# EAGLE design me433_2019_pic32 (EAGLE 9.3.2)
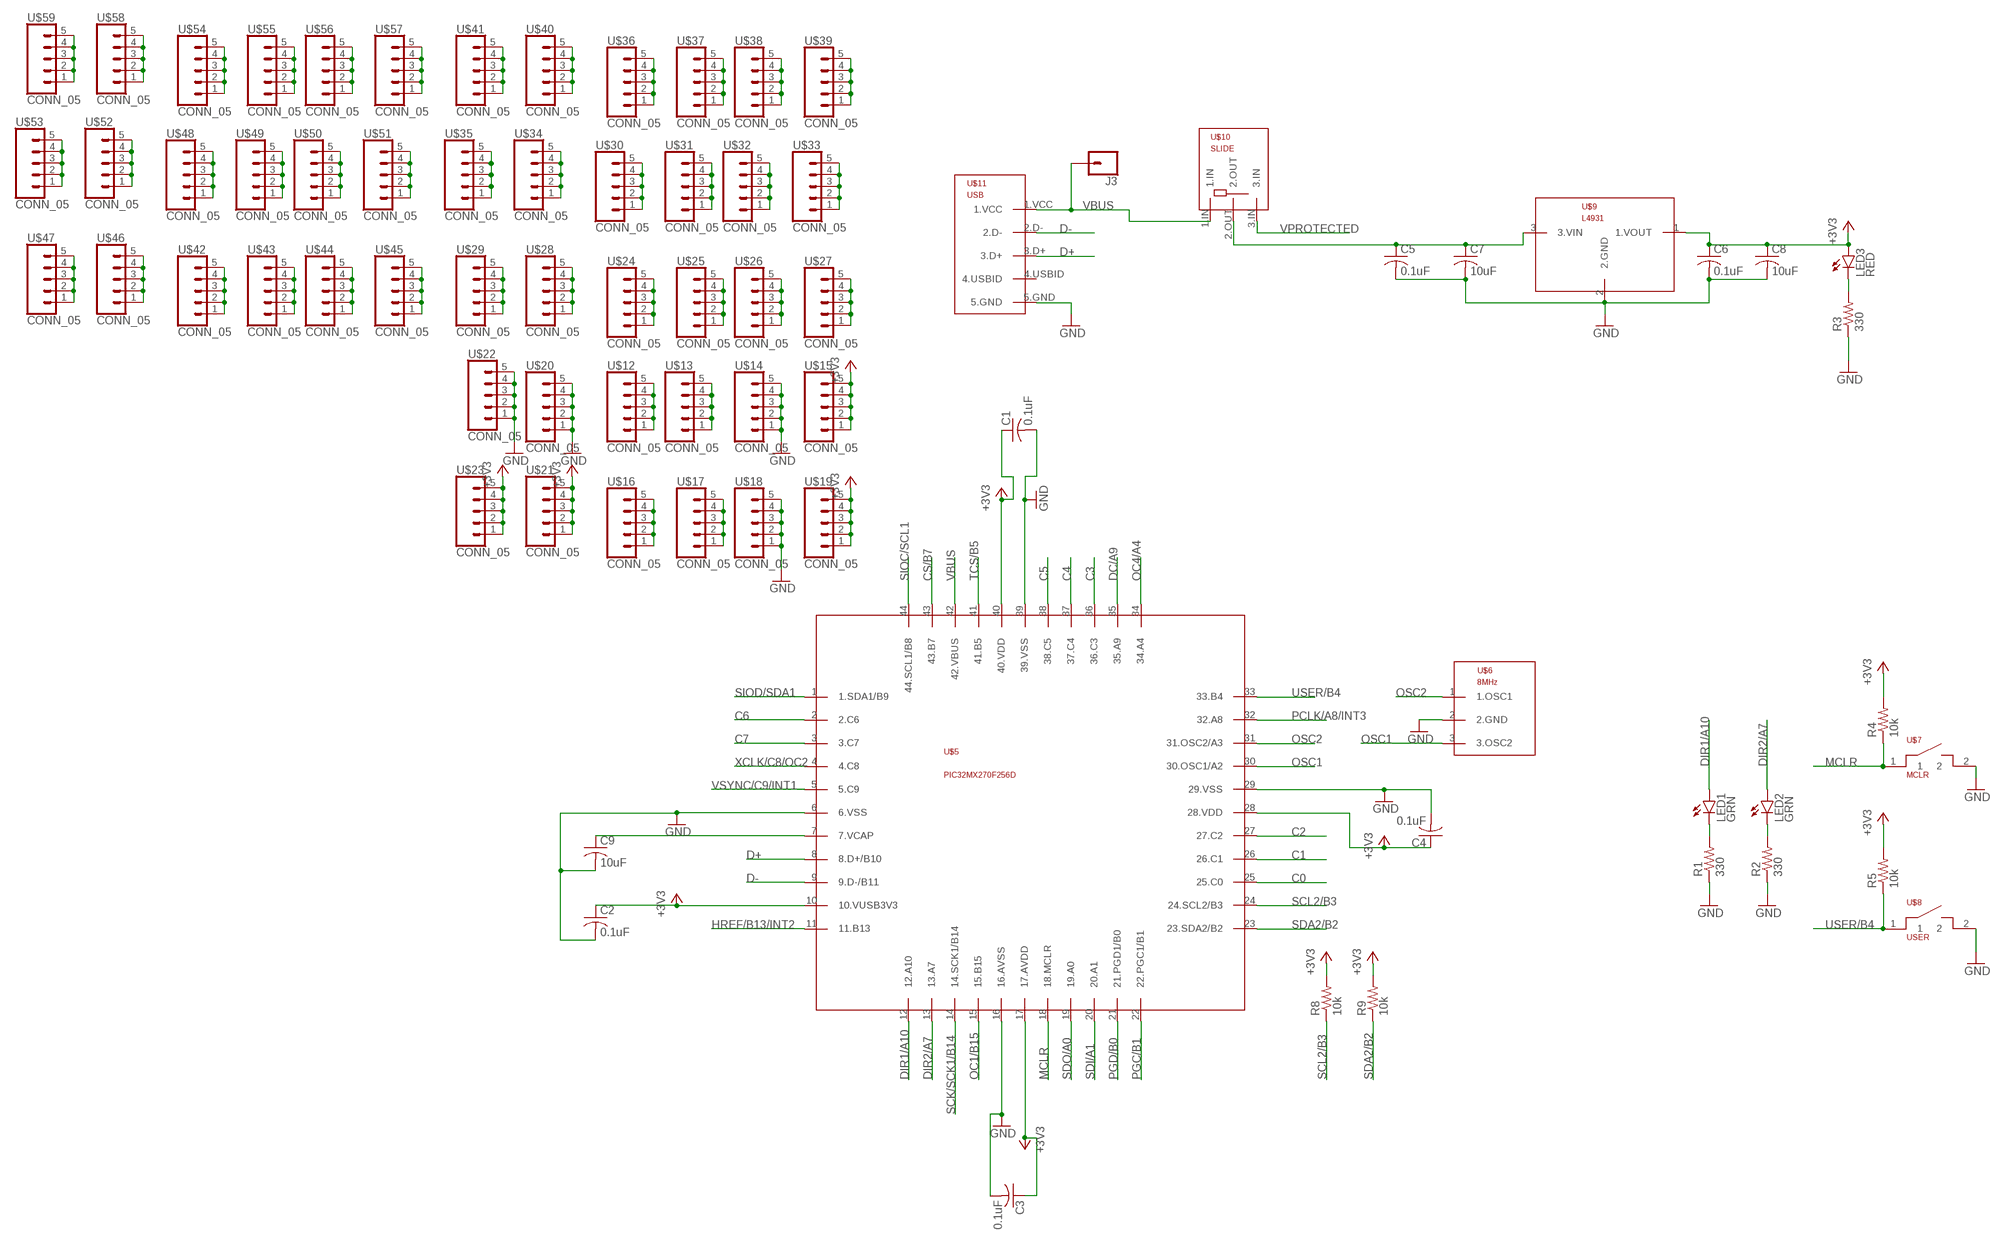
[diagram p0: schematic, sheet 1, part 1 of 2]
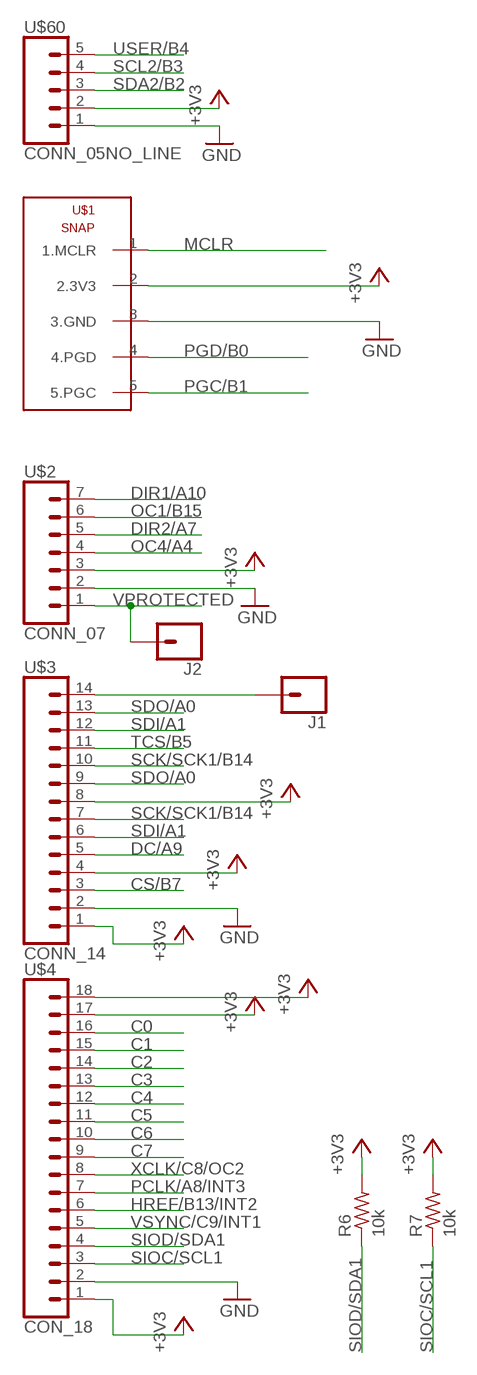
[diagram p1: schematic, sheet 1, part 2 of 2]

## Parts
C1  0.1uF  C-US025-030X050  [C025-030X050]
C2  0.1uF  C-US025-030X050  [C025-030X050]
C3  0.1uF  C-US025-030X050  [C025-030X050]
C4  0.1uF  C-US025-030X050  [C025-030X050]
C5  0.1uF  C-US025-030X050  [C025-030X050]
C6  0.1uF  C-US025-030X050  [C025-030X050]
C7  10uF  C-US025-030X050  [C025-030X050]
C8  10uF  C-US025-030X050  [C025-030X050]
C9  10uF  C-US025-030X050  [C025-030X050]
J1  CONN_01  [1X01]
J2  CONN_01  [1X01]
J3  CONN_01  [1X01]
LED1  GRN  LED3MM  [LED3MM]
LED2  GRN  LED3MM  [LED3MM]
LED3  RED  LED3MM  [LED3MM]
R1  330  R-US_0207/10  [0207/10]
R2  330  R-US_0207/10  [0207/10]
R3  330  R-US_0207/10  [0207/10]
R4  10k  R-US_0207/10  [0207/10]
R5  10k  R-US_0207/10  [0207/10]
R6  10k  R-US_0207/10  [0207/10]
R7  10k  R-US_0207/10  [0207/10]
R8  10k  R-US_0207/10  [0207/10]
R9  10k  R-US_0207/10  [0207/10]
U$1  SNAP  SNAPSNAP  [SNAP]
U$2  CONN_07  [1X07]
U$3  CONN_14  [1X14]
U$4  CON_18  [1X18]
U$5  PIC32MX270F256D  [TQFP44]
U$6  8MHz  OSC  [OSC]
U$7  MCLR  PB  [PB]
U$8  USER  PB  [PB]
U$9  L4931  [L4931]
U$10  SLIDE  [SLIDE]
U$11  USB  [USB]
U$12  CONN_05  [1X05]
U$13  CONN_05  [1X05]
U$14  CONN_05  [1X05]
U$15  CONN_05  [1X05]
U$16  CONN_05  [1X05]
U$17  CONN_05  [1X05]
U$18  CONN_05  [1X05]
U$19  CONN_05  [1X05]
U$20  CONN_05  [1X05]
U$21  CONN_05  [1X05]
U$22  CONN_05  [1X05]
U$23  CONN_05  [1X05]
U$24  CONN_05  [1X05]
U$25  CONN_05  [1X05]
U$26  CONN_05  [1X05]
U$27  CONN_05  [1X05]
U$28  CONN_05  [1X05]
U$29  CONN_05  [1X05]
U$30  CONN_05  [1X05]
U$31  CONN_05  [1X05]
U$32  CONN_05  [1X05]
U$33  CONN_05  [1X05]
U$34  CONN_05  [1X05]
U$35  CONN_05  [1X05]
U$36  CONN_05  [1X05]
U$37  CONN_05  [1X05]
U$38  CONN_05  [1X05]
U$39  CONN_05  [1X05]
U$40  CONN_05  [1X05]
U$41  CONN_05  [1X05]
U$42  CONN_05  [1X05]
U$43  CONN_05  [1X05]
U$44  CONN_05  [1X05]
U$45  CONN_05  [1X05]
U$46  CONN_05  [1X05]
U$47  CONN_05  [1X05]
U$48  CONN_05  [1X05]
U$49  CONN_05  [1X05]
U$50  CONN_05  [1X05]
U$51  CONN_05  [1X05]
U$52  CONN_05  [1X05]
U$53  CONN_05  [1X05]
U$54  CONN_05  [1X05]
U$55  CONN_05  [1X05]
U$56  CONN_05  [1X05]
U$57  CONN_05  [1X05]
U$58  CONN_05  [1X05]
U$59  CONN_05  [1X05]
U$60  CONN_05NO_LINE  [1X05_NO_LINE]

## Nets
+3V3: C1.1 C2.1 C3.1 C4.1 C6.1 C8.1 LED3.A R4.2 R5.2 R6.2 R7.2 R8.2 R9.2 U$1.2(2.3V3) U$2.3 U$3.1 U$3.4 U$3.8 U$4.1 U$4.17 U$4.18 U$5.10(10.VUSB3V3) U$5.17(17.AVDD) U$5.28(28.VDD) U$5.40(40.VDD) U$9.1(1.VOUT) U$15.1 U$15.2 U$15.3 U$15.4 U$15.5 U$19.1 U$19.2 U$19.3 U$19.4 U$19.5 U$21.1 U$21.2 U$21.3 U$21.4 U$21.5 U$23.1 U$23.2 U$23.3 U$23.4 U$23.5 U$60.2
C0: U$4.16 U$5.25(25.C0)
C1: U$4.15 U$5.26(26.C1)
C2: U$4.14 U$5.27(27.C2)
C3: U$4.13 U$5.36(36.C3)
C4: U$4.12 U$5.37(37.C4)
C5: U$4.11 U$5.38(38.C5)
C6: U$4.10 U$5.2(2.C6)
C7: U$4.9 U$5.3(3.C7)
CS/B7: U$3.3 U$5.43(43.B7)
D+: U$5.8(8.D+/B10) U$11.3.D+
D-: U$5.9(9.D-/B11) U$11.2.D-
DC/A9: U$3.5 U$5.35(35.A9)
DIR1/A10: LED1.A U$2.7 U$5.12(12.A10)
DIR2/A7: LED2.A U$2.5 U$5.13(13.A7)
GND: C1.2 C2.2 C3.2 C4.2 C5.2 C6.2 C7.2 C8.2 C9.2 R1.1 R2.1 R3.1 U$1.3(3.GND) U$2.2 U$3.2 U$4.2 U$5.6(6.VSS) U$5.16(16.AVSS) U$5.29(29.VSS) U$5.39(39.VSS) U$6.2(2.GND) U$7.2 U$8.2 U$9.2(2.GND) U$11.5.GND U$14.1 U$14.2 U$14.3 U$14.4 U$14.5 U$18.1 U$18.2 U$18.3 U$18.4 U$18.5 U$20.1 U$20.2 U$20.3 U$20.4 U$20.5 U$22.1 U$22.2 U$22.3 U$22.4 U$22.5 U$60.1
HREF/B13/INT2: U$4.6 U$5.11(11.B13)
MCLR: R4.1 U$1.1(1.MCLR) U$5.18(18.MCLR) U$7.1
N$1: C9.1 U$5.7(7.VCAP)
N$2: LED1.K(C) R1.2
N$3: LED2.K(C) R2.2
N$4: J1.1 U$3.14
N$5: C5.1 C7.1 U$9.3(3.VIN) U$10.2.OUT
N$6: U$12.1 U$12.2 U$12.3 U$12.4 U$12.5
N$7: U$13.1 U$13.2 U$13.3 U$13.4 U$13.5
N$9: LED3.K(C) R3.2
N$11: U$16.1 U$16.2 U$16.3 U$16.4 U$16.5
N$12: U$17.1 U$17.2 U$17.3 U$17.4 U$17.5
N$19: U$24.1 U$24.2 U$24.3 U$24.4 U$24.5
N$20: U$25.1 U$25.2 U$25.3 U$25.4 U$25.5
N$21: U$26.1 U$26.2 U$26.3 U$26.4 U$26.5
N$22: U$27.1 U$27.2 U$27.3 U$27.4 U$27.5
N$23: U$28.1 U$28.2 U$28.3 U$28.4 U$28.5
N$24: U$29.1 U$29.2 U$29.3 U$29.4 U$29.5
N$25: U$30.1 U$30.2 U$30.3 U$30.4 U$30.5
N$26: U$31.1 U$31.2 U$31.3 U$31.4 U$31.5
N$27: U$32.1 U$32.2 U$32.3 U$32.4 U$32.5
N$28: U$33.1 U$33.2 U$33.3 U$33.4 U$33.5
N$29: U$34.1 U$34.2 U$34.3 U$34.4 U$34.5
N$30: U$35.1 U$35.2 U$35.3 U$35.4 U$35.5
N$31: U$36.1 U$36.2 U$36.3 U$36.4 U$36.5
N$32: U$37.1 U$37.2 U$37.3 U$37.4 U$37.5
N$33: U$38.1 U$38.2 U$38.3 U$38.4 U$38.5
N$34: U$39.1 U$39.2 U$39.3 U$39.4 U$39.5
N$35: U$40.1 U$40.2 U$40.3 U$40.4 U$40.5
N$36: U$41.1 U$41.2 U$41.3 U$41.4 U$41.5
N$37: U$42.1 U$42.2 U$42.3 U$42.4 U$42.5
N$38: U$43.1 U$43.2 U$43.3 U$43.4 U$43.5
N$39: U$44.1 U$44.2 U$44.3 U$44.4 U$44.5
N$40: U$45.1 U$45.2 U$45.3 U$45.4 U$45.5
N$41: U$46.1 U$46.2 U$46.3 U$46.4 U$46.5
N$42: U$47.1 U$47.2 U$47.3 U$47.4 U$47.5
N$43: U$48.1 U$48.2 U$48.3 U$48.4 U$48.5
N$44: U$49.1 U$49.2 U$49.3 U$49.4 U$49.5
N$45: U$50.1 U$50.2 U$50.3 U$50.4 U$50.5
N$46: U$51.1 U$51.2 U$51.3 U$51.4 U$51.5
N$47: U$52.1 U$52.2 U$52.3 U$52.4 U$52.5
N$48: U$53.1 U$53.2 U$53.3 U$53.4 U$53.5
N$49: U$54.1 U$54.2 U$54.3 U$54.4 U$54.5
N$50: U$55.1 U$55.2 U$55.3 U$55.4 U$55.5
N$51: U$56.1 U$56.2 U$56.3 U$56.4 U$56.5
N$52: U$57.1 U$57.2 U$57.3 U$57.4 U$57.5
N$53: U$58.1 U$58.2 U$58.3 U$58.4 U$58.5
N$54: U$59.1 U$59.2 U$59.3 U$59.4 U$59.5
OC1/B15: U$2.6 U$5.15(15.B15)
OC4/A4: U$2.4 U$5.34(34.A4)
OSC1: U$5.30(30.OSC1/A2) U$6.3(3.OSC2)
OSC2: U$5.31(31.OSC2/A3) U$6.1(1.OSC1)
PCLK/A8/INT3: U$4.7 U$5.32(32.A8)
PGC/B1: U$1.5(5.PGC) U$5.22(22.PGC1/B1)
PGD/B0: U$1.4(4.PGD) U$5.21(21.PGD1/B0)
SCK/SCK1/B14: U$3.7 U$3.10 U$5.14(14.SCK1/B14)
SCL2/B3: R8.1 U$5.24(24.SCL2/B3) U$60.4
SDA2/B2: R9.1 U$5.23(23.SDA2/B2) U$60.3
SDI/A1: U$3.6 U$3.12 U$5.20(20.A1)
SDO/A0: U$3.9 U$3.13 U$5.19(19.A0)
SIOC/SCL1: R7.1 U$4.3 U$5.44(44.SCL1/B8)
SIOD/SDA1: R6.1 U$4.4 U$5.1(1.SDA1/B9)
TCS/B5: U$3.11 U$5.41(41.B5)
USER/B4: R5.1 U$5.33(33.B4) U$8.1 U$60.5
VBUS: J3.1 U$5.42(42.VBUS) U$10.1.IN U$11.1.VCC
VPROTECTED: J2.1 U$2.1 U$10.3.IN
VSYNC/C9/INT1: U$4.5 U$5.5(5.C9)
XCLK/C8/OC2: U$4.8 U$5.4(4.C8)
Unconnected: U$11.4.USBID

## Library data of the parts
C1-C9 = resistor:C-US: CAPACITOR, American symbol
J1-J3 = SparkFun-Connectors:CONN_01: Single connection point. Often used as Generic Header-pin footprint for 0.1 inch spaced/style header connections On any of the 0.1 inch spaced packages, you can populate with these: Break Away Headers - Straight <https://www.sparkfun.com/products/116> (PRT-00116) Break Away Male Headers - Right Angle <https://www.sparkfun.com/products/553> (PRT-00553) Female Headers <https://www.sparkfun.com/products/115> (PRT-00115) Break Away Headers - Machine Pin <https://www.sparkfun.com/products/117> (PRT-00117) Break Away Female Headers - Swiss Machine Pin <https://www.sparkfun.com/products/743> (PRT-00743) This device is also useful as a general connection point to wire up your design to another part of your project. Our various solder wires solder well into these plated through hole pads. Hook-Up Wire - Assortment (Stranded, 22 AWG) <https://www.sparkfun.com/products/11375> (PRT-11375) Hook-Up Wire - Assortment (Solid Core, 22 AWG) <https://www.sparkfun.com/products/11367> (PRT-11367) View the entire wire category on our website here <https://www.sparkfun.com/categories/141> Special notes: SMTSO-256-ET is a "flush mount" nut for a 4-40 screw. We mostly use this on specialty testbeds; it is a nice way to connect hardware to your PCB at an adjustable hieght. Also note, the SNAP packages are for using a snappable style connector. We sell a baggie of snaps and they are also used on two LilyPad designs: Snap Assortment - 30 pack (male and female) <https://www.sparkfun.com/products/11347> (DEV-11347) LilyPad Arduino SimpleSnap <https://www.sparkfun.com/products/10941> (DEV-10941) LilyPad SimpleSnap Protoboard <https://www.sparkfun.com/products/10940> (DEV-10940)
LED1-LED3 = led:LED: LED OSRAM: - CHIPLED LG R971, LG N971, LY N971, LG Q971, LY Q971, LO R971, LY R971 LH N974, LH R974 LS Q976, LO Q976, LY Q976 LO Q996 - Hyper CHIPLED LW Q18S LB Q993, LB Q99A, LB R99A - SideLED LS A670, LO A670, LY A670, LG A670, LP A670 LB A673, LV A673, LT A673, LW A673 LH A674 LY A675 LS A676, LA A676, LO A676, LY A676, LW A676 LS A679, LY A679, LG A679 - Hyper Micro SIDELED® LS Y876, LA Y876, LO Y876, LY Y876 LT Y87S - SmartLED LW L88C, LW L88S LB L89C, LB L89S, LG L890 LS L89K, LO L89K, LY L89K LS L896, LA L896, LO L896, LY L896 - TOPLED LS T670, LO T670, LY T670, LG T670, LP T670 LSG T670, LSP T670, LSY T670, LOP T670, LYG T670 LG T671, LOG T671, LSG T671 LB T673, LV T673, LT T673, LW T673 LH T674 LS T676, LA T676, LO T676, LY T676, LB T676, LH T676, LSB T676, LW T676 LB T67C, LV T67C, LT T67C, LS T67K, LO T67K, LY T67K, LW E67C LS E67B, LA E67B, LO E67B, LY E67B, LB E67C, LV E67C, LT E67C LW T67C LS T679, LY T679, LG T679 LS T770, LO T770, LY T770, LG T770, LP T770 LB T773, LV T773, LT T773, LW T773 LH T774 LS E675, LA E675, LY E675, LS T675 LS T776, LA T776, LO T776, LY T776, LB T776 LHGB T686 LT T68C, LB T68C - Hyper Mini TOPLED® LB M676 - Mini TOPLED Santana® LG M470 LS M47K, LO M47K, LY M47K Source: http://www.osram.convergy.de LUXEON: - LUMILED® LXK2-PW12-R00, LXK2-PW12-S00, LXK2-PW14-U00, LXK2-PW14-V00 LXK2-PM12-R00, LXK2-PM12-S00, LXK2-PM14-U00 LXK2-PE12-Q00, LXK2-PE12-R00, LXK2-PE12-S00, LXK2-PE14-T00, LXK2-PE14-U00 LXK2-PB12-K00, LXK2-PB12-L00, LXK2-PB12-M00, LXK2-PB14-N00, LXK2-PB14-P00, LXK2-PB14-Q00 LXK2-PR12-L00, LXK2-PR12-M00, LXK2-PR14-Q00, LXK2-PR14-R00 LXK2-PD12-Q00, LXK2-PD12-R00, LXK2-PD12-S00 LXK2-PH12-R00, LXK2-PH12-S00 LXK2-PL12-P00, LXK2-PL12-Q00, LXK2-PL12-R00 Source: www.luxeon.com KINGBRIGHT: KA-3528ASYC Source: www.kingbright.com
R1-R9 = resistor:R-US_: RESISTOR, American symbol
U$1 = me433_2019_pic32:SNAP
U$2 = me433_2019_pic32:CONN_07
U$3 = me433_2019_pic32:CONN_14
U$4 = me433_2019_pic32:CON_18
U$5 = me433_2019_pic32:PIC32MX270F256D
U$6 = me433_2019_pic32:OSC
U$7 U$8 = me433_2019_pic32:PB
U$9 = me433_2019_pic32:L4931
U$10 = me433_2019_pic32:SLIDE
U$11 = me433_2019_pic32:USB
U$12-U$60 = me433_2019_pic32:CONN_05

## Board
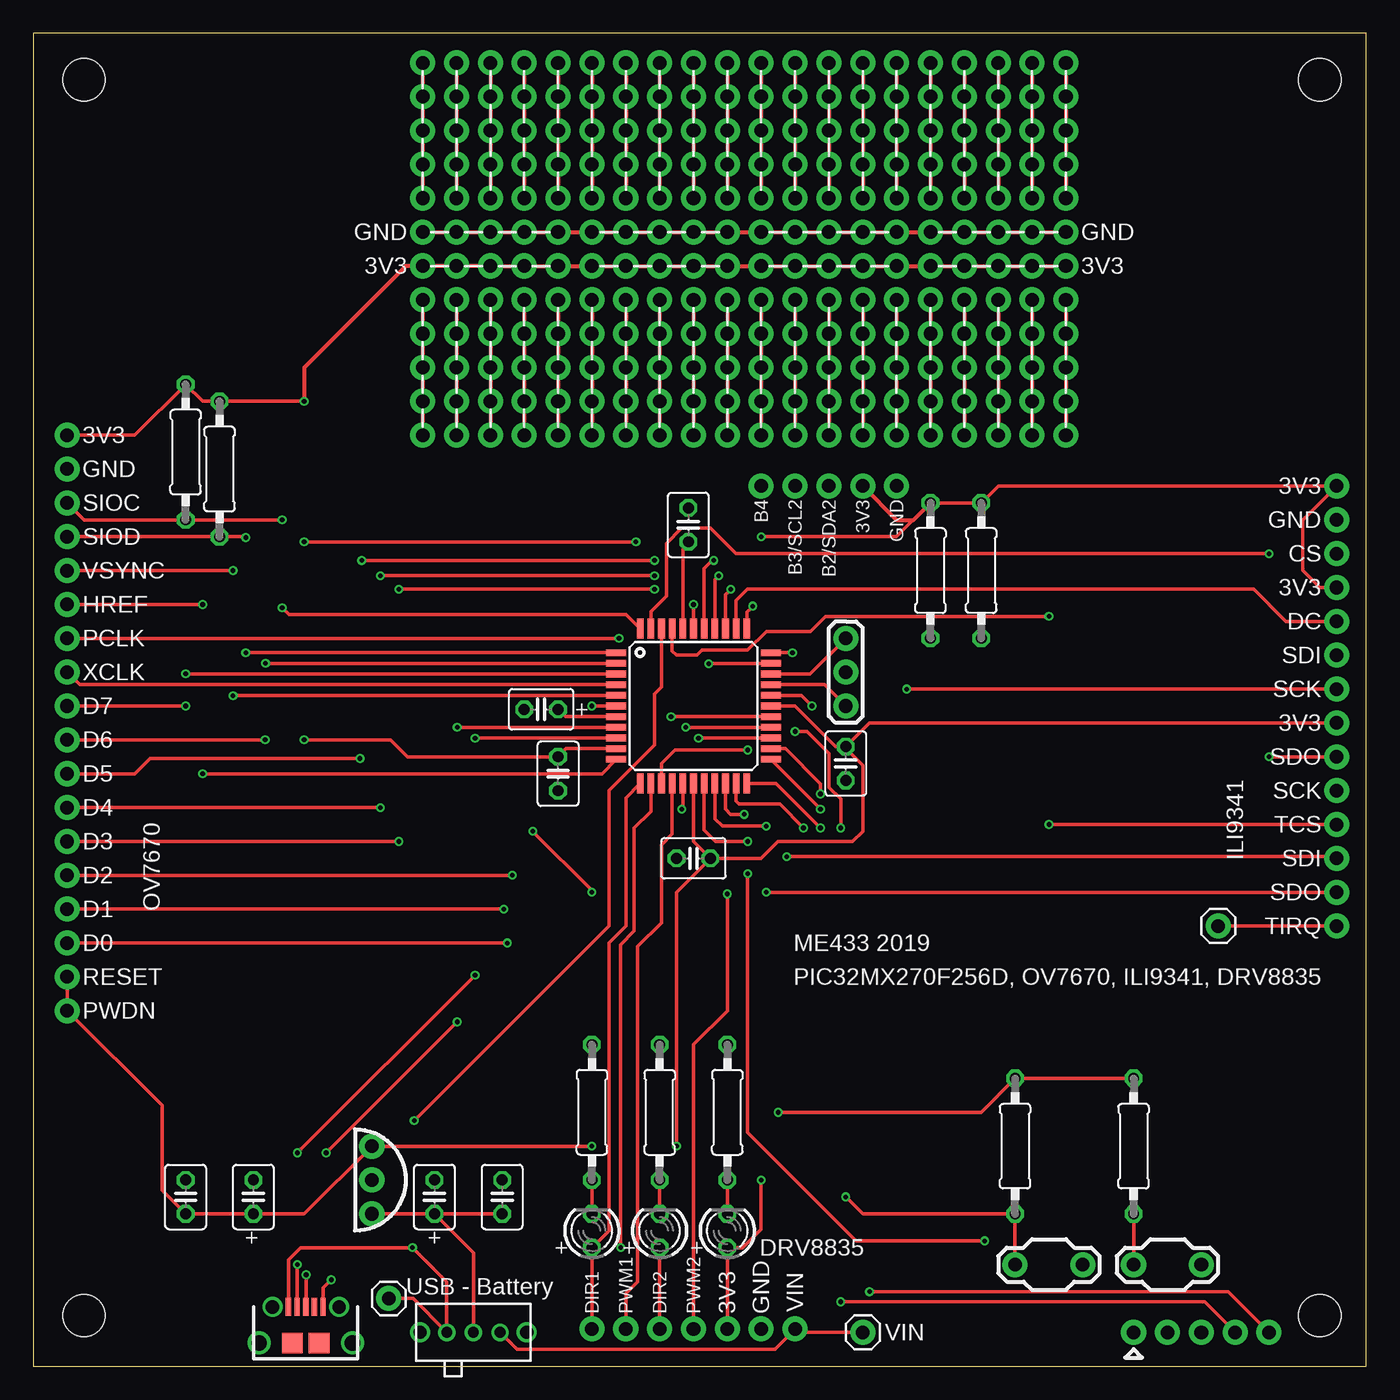
[diagram p2: board, top side]
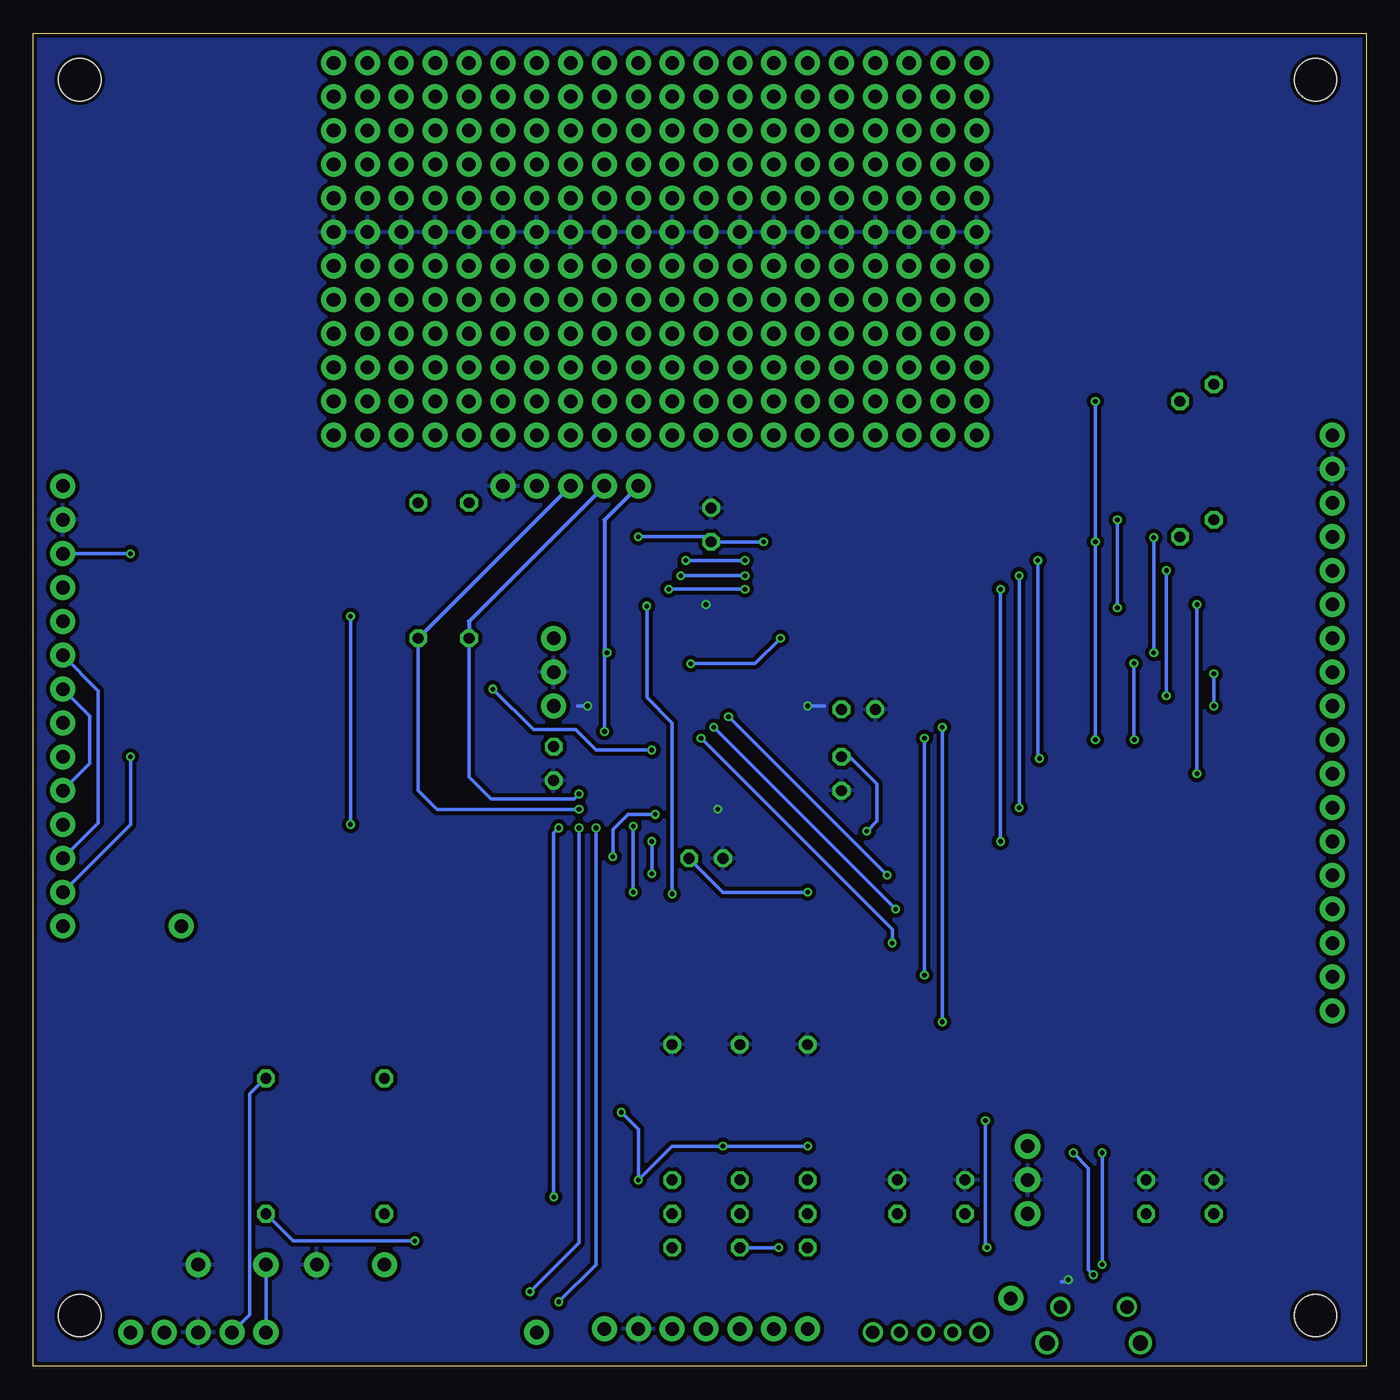
[diagram p3: board, bottom side, seen from below]

Size 100 x 100 mm. Coordinates in mm from the lower left corner, seen from the top.
Outline: 0,0 100,0 100,100 0,100 0,0
Copper layers (1*16): Top 0.035mm / dielectric 1.5mm / Bottom 0.035mm
Design rules "SeeedStudio_2layer_DRU_no_angle_20140221": minimum track width 6mil, minimum drill 12mil, track to track 6mil, track to pad 6mil, pad to pad 6mil, via to via 6mil, smd to smd 0mil, copper to edge 10mil, drill to drill 10mil, minimum pad ring 10mil, minimum via ring 6mil, stop-mask expansion 2mil, vias tented up to drill 100mil, thermal gap 10mil
Holes 3.17 mm at 3.81,96.52 96.52,96.52 3.81,3.81 96.52,3.81

### Footprints (pad centres in the part's own frame; a part is rotated, then mirrored left to right if it is on the bottom)
C025-030X050 = drill 0.813 octagon: 1 -1.27,0; 2 1.27,0
1X01 = drill 1.016 pad 1.88: 1 0,0
LED3MM = drill 0.813 octagon: A -1.27,0; K 1.27,0
0207/10 = drill 0.813 octagon: 1 -5.08,0; 2 5.08,0
SNAP = drill 1.016 pad 1.88: 1 0,0; 2 2.54,0; 3 5.08,0; 4 7.62,0; 5 10.16,0
1X07 = drill 1.016 pad 1.88: 1 0,0; 2 2.54,0; 3 5.08,0; 4 7.62,0; 5 10.16,0; 6 12.7,0; 7 15.24,0
1X14 = drill 1.016 pad 1.88: 1 0,0; 2 2.54,0; 3 5.08,0; 4 7.62,0; 5 10.16,0; 6 12.7,0; 7 15.24,0; 8 17.78,0; 9 20.32,0; 10 22.86,0; 11 25.4,0; 12 27.94,0; 13 30.48,0; 14 33.02,0
1X18 = drill 1.016 pad 1.88: 1 0,0; 2 2.54,0; 3 5.08,0; 4 7.62,0; 5 10.16,0; 6 12.7,0; 7 15.24,0; 8 17.78,0; 9 20.32,0; 10 22.86,0; 11 25.4,0; 12 27.94,0; 13 30.48,0; 14 33.02,0; 15 35.56,0; 16 38.1,0; 17 40.64,0; 18 43.18,0
TQFP44 = smd 1.5 x 0.5: 1 -5.8,4; 2 -5.8,3.2; 3 -5.8,2.4; 4 -5.8,1.6; 5 -5.8,0.8; 6 -5.8,0; 7 -5.8,-0.8; 8 -5.8,-1.6; 9 -5.8,-2.4; 10 -5.8,-3.2; 11 -5.8,-4; 23 5.8,-4; 24 5.8,-3.2; 25 5.8,-2.4; 26 5.8,-1.6; 27 5.8,-0.8; 28 5.8,0; 29 5.8,0.8; 30 5.8,1.6; 31 5.8,2.4; 32 5.8,3.2; 33 5.8,4 | smd 0.5 x 1.5: 12 -4,-5.8; 13 -3.2,-5.8; 14 -2.4,-5.8; 15 -1.6,-5.8; 16 -0.8,-5.8; 17 0,-5.8; 18 0.8,-5.8; 19 1.6,-5.8; 20 2.4,-5.8; 21 3.2,-5.8; 22 4,-5.8; 34 4,5.8; 35 3.2,5.8; 36 2.4,5.8; 37 1.6,5.8; 38 0.8,5.8; 39 0,5.8; 40 -0.8,5.8; 41 -1.6,5.8; 42 -2.4,5.8; 43 -3.2,5.8; 44 -4,5.8
OSC = drill 1.016 pad 1.88: 1 -2.54,0; 2 0,0; 3 2.54,0
PB = drill 1.016 pad 1.88: 1 -2.54,0; 2 2.54,0
L4931 = drill 1.016 pad 1.88: 1 -2.54,0; 2 0,0; 3 2.54,0
SLIDE = drill 0.8: 1.IN -2,0; 2.OUT 0,0; 3.IN 2,0 | drill 1: 4.SUPPORT -4,0; 5.SUPPORT 4,0
USB = smd 0.4 x 1.35: 1.VCC -1.3,0; 2.D- -0.65,0; 3.D+ 0,0; 4.USBID 0.65,0; 5.GND 1.3,0 | drill 1: P$1 -2.5,0; P$2 2.5,0 | smd 1.55 x 1.55: P$3 1,-2.7; P$4 -1,-2.7 | drill 1.15: P$5 -3.5,-2.7; P$6 3.5,-2.7
1X05 = drill 1.016 pad 1.88: 1 0,0; 2 2.54,0; 3 5.08,0; 4 7.62,0; 5 10.16,0
1X05_NO_LINE = drill 1.016 pad 1.88: 1 0,0; 2 2.54,0; 3 5.08,0; 4 7.62,0; 5 10.16,0

### Placement (x,y rotation side)
C1  49.15,63.12 90 top
C2  39.37,44.45 270 top
C3  49.53,38.1 180 top
C4  60.96,45.21 270 top
C5  35.18,12.7 90 top
C6  11.43,12.7 90 top
C7  30.1,12.7 90 top
C8  16.51,12.7 90 top
C9  38.1,49.28 180 top
J1  88.9,33.02 0 top
J2  62.23,2.54 0 top
J3  26.67,5.08 0 top
LED1  41.91,10.16 90 top
LED2  46.99,10.16 90 top
LED3  52.07,10.16 90 top
R1  41.91,19.05 270 top
R2  46.99,19.05 270 top
R3  52.07,19.05 270 top
R4  82.55,16.51 90 top
R5  73.66,16.51 90 top
R6  13.97,67.31 90 top
R7  11.43,68.58 90 top
R8  67.31,59.69 90 top
R9  71.12,59.69 90 top
U$1  82.55,2.54 0 top
U$2  57.15,2.79 180 top
U$3  97.79,66.04 270 top
U$4  2.54,69.85 270 top
U$5  49.53,49.53 0 top
U$6  60.96,52.07 270 top
U$7  85.09,7.62 0 top
U$8  76.2,7.62 0 top
U$9  25.4,13.97 270 top
U$10  33.02,2.54 0 top
U$11  20.45,4.45 0 top
U$12  29.21,87.63 90 top
U$13  31.75,87.63 90 top
U$14  29.21,85.09 0 top
U$15  29.21,82.55 0 top
U$16  29.21,80.01 270 top
U$17  31.75,80.01 270 top
U$18  41.91,85.09 0 top
U$19  41.91,82.55 0 top
U$20  54.61,85.09 0 top
U$21  54.61,82.55 0 top
U$22  67.31,85.09 0 top
U$23  67.31,82.55 0 top
U$24  34.29,80.01 270 top
U$25  36.83,80.01 270 top
U$26  39.37,80.01 270 top
U$27  41.91,80.01 270 top
U$28  44.45,80.01 270 top
U$29  46.99,80.01 270 top
U$30  49.53,80.01 270 top
U$31  52.07,80.01 270 top
U$32  54.61,80.01 270 top
U$33  57.15,80.01 270 top
U$34  59.69,80.01 270 top
U$35  69.85,80.01 270 top
U$36  72.39,80.01 270 top
U$37  77.47,80.01 270 top
U$38  62.23,80.01 270 top
U$39  64.77,80.01 270 top
U$40  74.93,80.01 270 top
U$41  67.31,80.01 270 top
U$42  34.29,97.79 270 top
U$43  36.83,97.79 270 top
U$44  39.37,97.79 270 top
U$45  41.91,97.79 270 top
U$46  44.45,97.79 270 top
U$47  46.99,97.79 270 top
U$48  59.69,97.79 270 top
U$49  62.23,97.79 270 top
U$50  67.31,97.79 270 top
U$51  74.93,97.79 270 top
U$52  49.53,97.79 270 top
U$53  52.07,97.79 270 top
U$54  54.61,97.79 270 top
U$55  57.15,97.79 270 top
U$56  64.77,97.79 270 top
U$57  69.85,97.79 270 top
U$58  72.39,97.79 270 top
U$59  77.47,97.79 270 top
U$60  64.77,66.04 180 top

### Tracks (layer width: path | path; a pad name or v marks a point on that pad's centre or on a via)
+3V3  (via drill 0.35)
  Top 0.254: U$5.28 57.15,49.53 60.2,46.48 60.83,46.48 | 60.83,46.48 C4.1 62.74,48.26 U$3.8 | U$5.40 48.73,61.27 C1.1 | U$5.10 39.98,46.33 C2.1 28.07,45.72 26.8,46.99 v20.32,46.99 | U$5.17 49.53,39.37 C3.1 | U$2.3 LED3.A 53.21,8.89 54.61,10.29 v54.61,13.97 | R4.2 R5.2 71.12,19.05 v55.88,19.05 | U$4.17 U$4.18 9.65,19.56 9.65,13.21 C6.1 C8.1 20.32,11.43 U$9.1 v41.91,16.51 | C3.1 48.26,35.56 v48.26,16.51 | v37.47,40.13 41.91,35.69 v41.91,35.56 | v20.32,72.39 R6.2 12.7,72.39 R7.2 7.62,69.85 U$4.1 | v54.61,62.23 64.77,62.23 R8.2 R9.2 72.39,66.04 U$3.1 95.25,63.5 95.25,59.69 96.52,58.42 U$3.4 | v45.21,61.85 v20.32,61.85 | C3.1 54.61,38.1 55.88,39.37 61.47,39.37 62.23,40.13 62.23,45.09 60.83,46.48
  Top 0.305: U$23.5 U$23.4 U$23.3 U$23.2 U$23.1 U$21.5 U$21.4 U$21.3 U$21.2 U$21.1 U$19.5 U$19.4 U$19.3 U$19.2 U$19.1 U$15.5 U$15.4 U$15.3 U$15.2 U$15.1 27.94,82.55 20.32,74.93 v20.32,72.39 | U$60.2 64.77,63.5 66.04,63.5 R8.2
  Bottom 0.254: U$1.2 83.77,3.86 83.77,20.43 82.61,21.59 R4.2 | v41.91,16.51 v48.26,16.51 52.07,16.51 v54.61,13.97 54.61,17.78 v55.88,19.05 | C2.1 38.73,45.72 36.7,43.69 36.7,40.89 v37.47,40.13 | v41.91,35.56 48.26,35.56 C3.1 | v20.32,46.99 v20.32,61.85 v20.32,72.39 | v54.61,62.23 49.53,62.23 C1.1 v45.21,61.85
C0  (via drill 0.35)
  Top 0.254: v49.91,47.12 49.92,47.13 U$5.25 | v35.56,31.75 U$4.16
  Bottom 0.254: v49.91,47.12 35.56,32.77 v35.56,31.75
C1  (via drill 0.35)
  Top 0.254: v35.31,34.29 U$4.15 | U$5.26 v48.95,47.93
  Bottom 0.254: v48.95,47.93 v35.31,34.29
C2  (via drill 0.35)
  Top 0.254: v35.94,36.83 U$4.14 | U$5.27 v47.84,48.73
  Bottom 0.254: v47.84,48.73 36.07,36.96 36.07,36.83 v35.94,36.83
C3  (via drill 0.35)
  Top 0.254: U$5.36 51.93,57.9 v52.32,58.29 | v46.61,58.29 v27.43,58.29 | v27.43,39.37 U$4.13
  Bottom 0.254: v52.32,58.29 v46.61,58.29 | v27.43,58.29 v27.43,39.37
C4  (via drill 0.35)
  Top 0.254: U$5.37 51.13,59 v51.44,59.31 | v46.61,59.31 v26.04,59.31 | v26.04,41.91 U$4.12
  Bottom 0.254: v26.04,59.31 v26.04,41.91 | v51.44,59.31 v46.61,59.31
C5  (via drill 0.35)
  Top 0.254: U$5.38 50.33,59.85 50.93,60.45 v51.05,60.45 | v46.61,60.45 v24.64,60.45 | v24.51,45.59 8.76,45.59 7.62,44.45 U$4.11
  Bottom 0.254: v51.05,60.45 v46.61,60.45 | v24.64,60.45 24.64,45.72 v24.51,45.59
C6  (via drill 0.35)
  Top 0.254: U$5.2 v17.42,52.73 | v17.4,46.99 U$4.10
  Bottom 0.254: v17.42,52.73 17.42,47.02 v17.4,46.99
C7  (via drill 0.35)
  Top 0.254: U$5.3 11.44,51.93 v11.43,51.94 | v11.43,49.53 U$4.9
  Bottom 0.254: v11.43,51.94 v11.43,49.53
CS/B7  (via drill 0.35)
  Top 0.254: U$5.43 46.33,56.62 47.5,57.78 47.5,61.72 48.64,62.87 50.8,62.87 52.7,60.96 v92.71,60.96
  Bottom 0.254: U$3.3 v92.71,60.96
D+  (via drill 0.35)
  Top 0.254: U$5.8 v31.8,47.93 | v31.8,25.83 v21.97,16 | v20.47,6.86 20.47,4.47 U$11.3.D+
  Bottom 0.254: v31.8,47.93 v31.8,25.83 | v21.97,16 20.83,14.86 20.83,7.24 20.45,6.86 v20.47,6.86
D-  (via drill 0.35)
  Top 0.254: U$5.9 43.72,47.12 v33.15,47.12 | v19.81,7.62 19.81,4.46 U$11.2.D- | v33.15,29.34 v19.81,16
  Bottom 0.254: v33.15,47.12 v33.15,29.34 | v19.81,16 v19.81,7.62
DC/A9
  Top 0.254: U$5.35 52.73,57.43 53.59,58.29 91.57,58.29 93.98,55.88 U$3.5
DIR1/A10
  Top 0.254: U$2.7 LED1.A 43.18,10.16 43.18,31.75 44.45,33.02 44.45,42.65 U$5.12
DIR2/A7  (via drill 0.35)
  Top 0.254: U$2.5 LED2.A | U$5.13 46.33,41.63 45.09,40.39 45.09,32.64 44.07,31.62 v44.07,8.89
  Bottom 0.254: v44.07,8.89 LED2.A
GND  (via drill 0.35)
  Top 0.254: U$5.29 57.62,50.33 v58.42,49.53 | U$5.39 v49.53,57.15 | U$5.6 v41.91,49.53 | U$5.16 48.73,41.87 v48.64,41.78 | U$11.5.GND 21.75,5.87 v22.35,6.48
  Top 0.305: U$22.5 U$22.4 U$22.3 U$22.2 U$22.1 U$20.5 U$20.4 U$20.3 U$20.2 U$20.1 U$18.5 U$18.4 U$18.3 U$18.2 U$18.1 U$14.5 U$14.4 U$14.3 U$14.2 U$14.1
  Bottom 0.254: v58.42,49.53 59.18,49.53 | v41.91,49.53 40.64,49.53 | v22.35,6.48 22.48,6.35 22.86,6.35
  pour Bottom (isolate 0.305): 0,0 0,100.33 100.33,100.33 100.33,0
HREF/B13/INT2  (via drill 0.35)
  Top 0.254: U$5.11 42.65,44.45 v12.7,44.45 | v12.7,57.15 U$4.6
  Bottom 0.254: v12.7,44.45 v12.7,57.15
MCLR  (via drill 0.35)
  Top 0.254: U$7.1 R4.1 | U$5.18 50.33,40.64 50.33,40.22 51.18,39.37 v53.59,39.37 | v53.59,36.96 53.59,17.53 61.72,9.4 v71.37,9.4
  Bottom 0.254: v71.37,9.4 80.52,9.4 R4.1 | U$1.1 U$7.1 | v53.59,39.37 v53.59,36.96
N$1
  Top 0.254: U$5.7 39.92,48.73 C9.1
N$2
  Top 0.254: R1.2 LED1.K
N$3
  Top 0.254: R2.2 LED2.K
N$4
  Top 0.254: J1.1 U$3.14
N$5
  Top 0.254: C7.1 C5.1 | U$10.2.OUT 33.02,8.51 C7.1 | C7.1 U$9.3
N$6
  Top 0.305: U$12.5 U$12.4 U$12.3 U$12.2 U$12.1
N$7
  Top 0.305: U$13.5 U$13.4 U$13.3 U$13.2 U$13.1
N$9
  Top 0.254: R3.2 LED3.K
N$11
  Top 0.305: U$16.1 U$16.2 U$16.3 U$16.4 U$16.5
N$12
  Top 0.305: U$17.1 U$17.2 U$17.3 U$17.4 U$17.5
N$19
  Top 0.305: U$24.1 U$24.2 U$24.3 U$24.4 U$24.5
N$20
  Top 0.305: U$25.1 U$25.2 U$25.3 U$25.4 U$25.5
N$21
  Top 0.305: U$26.1 U$26.2 U$26.3 U$26.4 U$26.5
N$22
  Top 0.305: U$27.1 U$27.2 U$27.3 U$27.4 U$27.5
N$23
  Top 0.305: U$28.1 U$28.2 U$28.3 U$28.4 U$28.5
N$24
  Top 0.305: U$29.1 U$29.2 U$29.3 U$29.4 U$29.5
N$25
  Top 0.305: U$30.1 U$30.2 U$30.3 U$30.4 U$30.5
N$26
  Top 0.305: U$31.1 U$31.2 U$31.3 U$31.4 U$31.5
N$27
  Top 0.305: U$32.1 U$32.2 U$32.3 U$32.4 U$32.5
N$28
  Top 0.305: U$33.1 U$33.2 U$33.3 U$33.4 U$33.5
N$29
  Top 0.305: U$34.1 U$34.2 U$34.3 U$34.4 U$34.5
N$30
  Top 0.305: U$35.1 U$35.2 U$35.3 U$35.4 U$35.5
N$31
  Top 0.305: U$36.1 U$36.2 U$36.3 U$36.4 U$36.5
N$32
  Top 0.305: U$37.1 U$37.2 U$37.3 U$37.4 U$37.5
N$33
  Top 0.305: U$38.1 U$38.2 U$38.3 U$38.4 U$38.5
N$34
  Top 0.305: U$39.1 U$39.2 U$39.3 U$39.4 U$39.5
N$35
  Top 0.305: U$40.1 U$40.2 U$40.3 U$40.4 U$40.5
N$36
  Top 0.305: U$41.1 U$41.2 U$41.3 U$41.4 U$41.5
N$37
  Top 0.305: U$42.1 U$42.2 U$42.3 U$42.4 U$42.5
N$38
  Top 0.305: U$43.1 U$43.2 U$43.3 U$43.4 U$43.5
N$39
  Top 0.305: U$44.1 U$44.2 U$44.3 U$44.4 U$44.5
N$40
  Top 0.305: U$45.1 U$45.2 U$45.3 U$45.4 U$45.5
N$41
  Top 0.305: U$46.1 U$46.2 U$46.3 U$46.4 U$46.5
N$42
  Top 0.305: U$47.1 U$47.2 U$47.3 U$47.4 U$47.5
N$43
  Top 0.305: U$48.1 U$48.2 U$48.3 U$48.4 U$48.5
N$44
  Top 0.305: U$49.1 U$49.2 U$49.3 U$49.4 U$49.5
N$45
  Top 0.305: U$50.1 U$50.2 U$50.3 U$50.4 U$50.5
N$46
  Top 0.305: U$51.1 U$51.2 U$51.3 U$51.4 U$51.5
N$47
  Top 0.305: U$52.1 U$52.2 U$52.3 U$52.4 U$52.5
N$48
  Top 0.305: U$53.1 U$53.2 U$53.3 U$53.4 U$53.5
N$49
  Top 0.305: U$54.1 U$54.2 U$54.3 U$54.4 U$54.5
N$50
  Top 0.305: U$55.1 U$55.2 U$55.3 U$55.4 U$55.5
N$51
  Top 0.305: U$56.1 U$56.2 U$56.3 U$56.4 U$56.5
N$52
  Top 0.305: U$57.1 U$57.2 U$57.3 U$57.4 U$57.5
N$53
  Top 0.305: U$58.1 U$58.2 U$58.3 U$58.4 U$58.5
N$54
  Top 0.305: U$59.1 U$59.2 U$59.3 U$59.4 U$59.5
OC1/B15
  Top 0.254: U$5.15 47.93,39.93 47.12,39.12 47.12,33.27 45.34,31.5 45.34,6.35 44.45,5.46 U$2.6
OC4/A4  (via drill 0.35)
  Top 0.254: U$5.34 53.53,56.58 v53.98,57.02 | v52.07,35.43 52.07,26.67 49.53,24.13 U$2.4
  Bottom 0.254: v53.98,57.02 53.98,50.16 52.07,48.26 v52.07,35.43
OSC1
  Top 0.254: U$5.30 59.36,51.13 U$6.3
OSC2
  Top 0.254: U$5.31 58.28,51.93 U$6.1
PCLK/A8/INT3  (via drill 0.35)
  Top 0.254: U$5.32 50.7,52.73 v50.67,52.7 | U$4.7 v43.94,54.61
  Bottom 0.254: v50.67,52.7 45.85,52.7 v43.94,54.61
PGC/B1  (via drill 0.35)
  Top 0.254: U$5.22 55.71,43.73 v59.05,40.39 | v62.74,5.59 89.66,5.59 U$1.5
  Bottom 0.254: v59.05,40.39 59.05,9.27 v62.74,5.59
PGD/B0  (via drill 0.35)
  Top 0.254: U$5.21 52.73,42.39 52.96,42.16 56.01,42.16 v57.78,40.39 | U$1.4 87.88,4.83 v60.58,4.83
  Bottom 0.254: v57.78,40.39 57.78,7.62 v60.58,4.83
SCK/SCK1/B14  (via drill 0.35)
  Top 0.254: U$5.14 47.13,45.23 48.13,46.23 v53.59,46.23 | v65.53,50.8 U$3.7
  Bottom 0.254: v53.59,46.23 57.78,46.23 59.31,47.75 62.48,47.75 v65.53,50.8 | U$3.10 95.76,45.21 95.76,48.77 U$3.7
SCL2/B3  (via drill 0.35)
  Top 0.254: U$5.24 56.41,46.33 59.05,43.69 v59.05,42.93
  Bottom 0.254: v59.05,42.93 59.44,42.55 65.66,42.55 67.31,44.2 R8.1
  Bottom 0.305: R8.1 67.31,55.88 U$60.4
SDA2/B2  (via drill 0.35)
  Top 0.254: U$5.23 58.67,42.19 58.67,42.16 v59.05,41.78
  Bottom 0.254: v59.05,41.78 69.72,41.78 71.12,43.18 R9.1
  Bottom 0.305: U$60.3 R9.1
SDI/A1  (via drill 0.35)
  Top 0.254: U$5.20 51.93,41.8 52.32,41.4 v53.34,41.4 | v56.52,38.23 97.66,38.23 U$3.12
  Bottom 0.254: v53.34,41.4 55.37,41.4 56.52,40.26 v56.52,38.23 | U$3.12 95.12,40.77 95.12,50.67 U$3.6
SDO/A0  (via drill 0.35)
  Top 0.254: U$5.19 51.13,41.07 51.69,40.51 v54.99,40.51 | v54.99,35.56 U$3.13 | U$3.9 v92.71,45.72
  Bottom 0.254: v54.99,40.51 v54.99,35.56 | v92.71,45.72 92.71,40.64 U$3.13
SIOC/SCL1  (via drill 0.35)
  Top 0.254: U$4.3 3.81,63.5 R7.1 v18.67,63.5 | U$5.44 44.47,56.39 19.18,56.39 v18.67,56.9
  Bottom 0.254: v18.67,56.9 v18.67,63.5
SIOD/SDA1  (via drill 0.35)
  Top 0.254: U$5.1 v15.94,53.53 | v15.94,62.17 15.88,62.23 R6.1 U$4.4
  Bottom 0.254: v15.94,62.17 v15.94,53.53
TCS/B5  (via drill 0.35)
  Top 0.254: U$5.41 47.93,53.67 48.26,53.34 49.78,53.34 50.16,53.72 53.59,53.72 54.99,55.12 58.29,55.12 59.44,56.26 v76.2,56.26 | v76.2,40.64 U$3.11
  Bottom 0.254: v76.2,56.26 v76.2,40.64
USER/B4  (via drill 0.35)
  Top 0.254: U$8.1 R5.1 62.23,11.43 v60.96,12.7 | U$5.33 v56.96,53.53 | v57.15,47.62 58.04,47.62 59.69,45.97 59.69,43.43 60.58,42.55 v60.58,40.39
  Bottom 0.254: v56.96,53.53 57.15,53.34 v57.15,47.62 | v60.58,40.39 60.96,40.01 v60.96,12.7
  Bottom 0.305: U$60.5 57.15,63.5 57.15,53.72 v56.96,53.53
VBUS  (via drill 0.35)
  Top 0.254: U$11.1.VCC 19.15,7.97 20.07,8.89 v28.45,8.89 31.02,6.32 U$10.1.IN 28.48,5.08 J3.1 | U$5.42 47.13,50.94 46.61,50.42 46.61,46.61 43.18,43.18 43.18,33.02 v28.57,18.41
  Bottom 0.254: v28.57,18.41 28.57,9.02 v28.45,8.89
VPROTECTED
  Top 0.254: U$2.1 57.02,2.67 | 57.02,2.67 55.63,1.27 36.29,1.27 U$10.3.IN | J2.1 57.15,2.54 57.02,2.67
VSYNC/C9/INT1  (via drill 0.35)
  Top 0.254: U$5.5 15.02,50.33 v14.99,50.29 | v14.99,59.69 U$4.5
  Bottom 0.254: v14.99,50.29 v14.99,59.69
XCLK/C8/OC2
  Top 0.254: U$4.8 3.48,51.13 U$5.4

### Text on the board
tPlace: GND | GND | 3V3 | 3V3 | 3V3 | GND | 3V3 | B4 | B3/SCL2 | B2/SDA2 | 3V3 | GND | SIOC | GND | SIOD | CS | VSYNC | 3V3 | HREF | DC | PCLK | SDI | XCLK | SCK | D7 | + | 3V3 | D6 | SDO | D5 | SCK | D4 | TCS | D3 | SDI | ILI9341 | D2 | SDO | D1 | OV7670 | TIRQ | D0 | ME433 2019 | RESET | PIC32MX270F256D, OV7670, ILI9341, DRV8835 | PWDN | + | + | + | + | + | DRV8835 | USB - Battery | DIR1 | PWM1 | DIR2 | PWM2 | 3V3 | GND | VIN | VIN